# EAGLE design RS232Board (EAGLE 6.4)
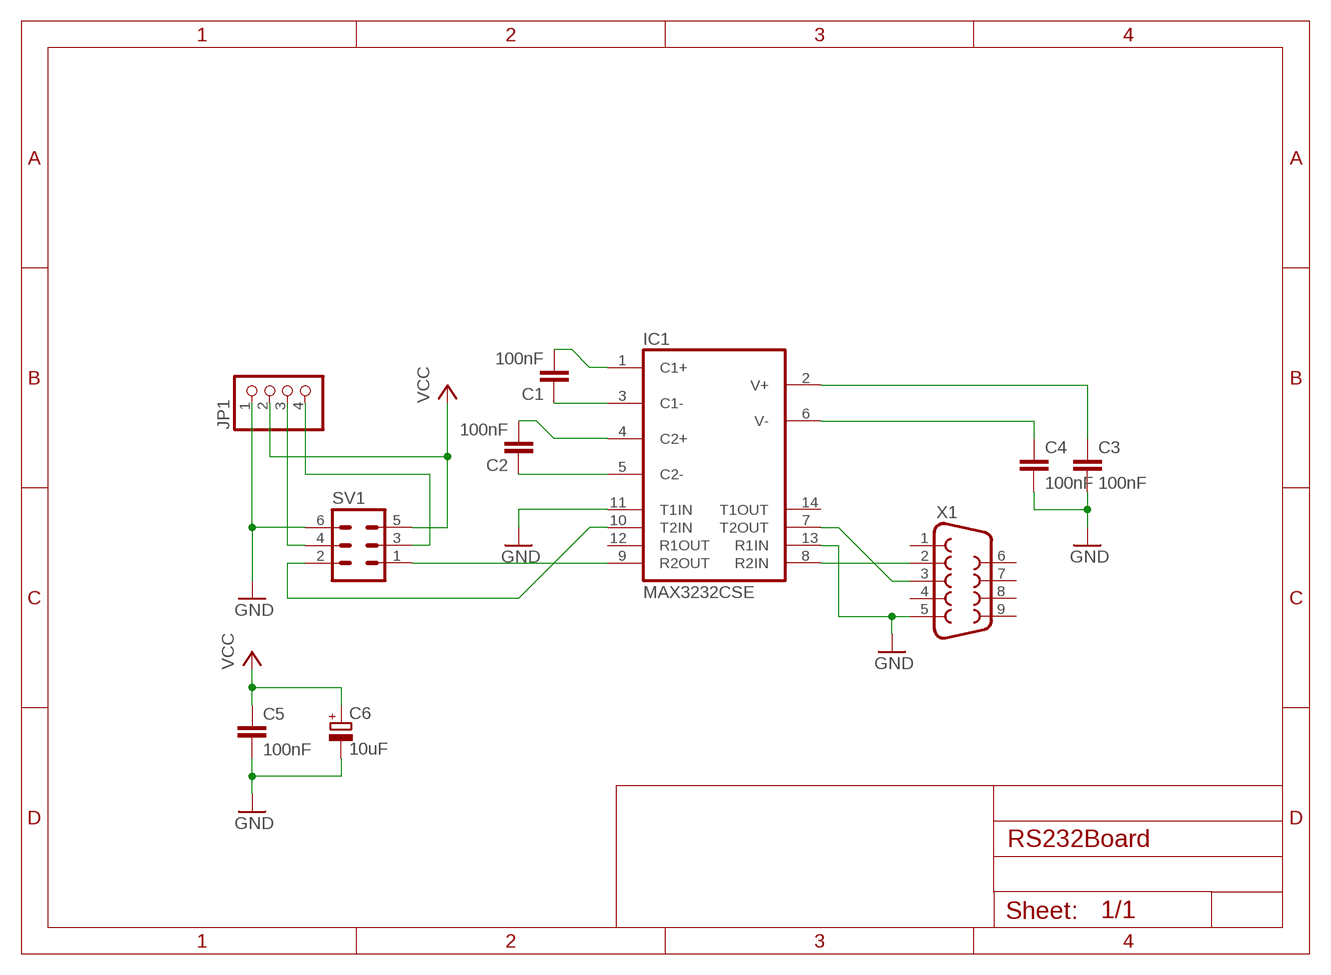
[diagram p0: schematic, sheet 1]

## Parts
C1  100nF  C-EUC1206  [C1206]
C2  100nF  C-EUC1206  [C1206]
C3  100nF  C-EUC1206  [C1206]
C4  100nF  C-EUC1206  [C1206]
C5  100nF  C-EUC1206  [C1206]
C6  10uF  CPOL-EUSMCC  [SMC_C]
IC1  MAX3232CSE  [SO16]
JP1  PINHD-1X4  [1X04]
SV1  ML6  [ML6]
X1  F09HP  [F09HP]

## Nets
GND: C3.2 C4.2 C5.2 C6.- IC1.11(T1IN) IC1.13(R1IN) JP1.1 SV1.6 X1.5
N$1: IC1.8(R2IN) X1.2
N$2: IC1.7(T2OUT) X1.3
N$3: C2.1 IC1.5(C2-)
N$4: C2.2 IC1.4(C2+)
N$5: C1.1 IC1.3(C1-)
N$6: C1.2 IC1.1(C1+)
N$7: C4.1 IC1.6(V-)
N$8: C3.1 IC1.2(V+)
N$9: JP1.3 SV1.4
N$10: IC1.9(R2OUT) SV1.1
N$11: IC1.10(T2IN) SV1.2
N$12: JP1.4 SV1.3
VCC: C5.1 C6.+ JP1.2 SV1.5
Unconnected: IC1.12(R1OUT) IC1.14(T1OUT) X1.1 X1.4 X1.6 X1.7 X1.8 X1.9

## Power pins joined to a net without a drawn wire
GND: IC1.15(GND)
VCC: IC1.16(VCC)

## Library data of the parts
C1-C5 = rcl:C-EU: CAPACITOR, European symbol
C6 = rcl:CPOL-EU: POLARIZED CAPACITOR, European symbol
IC1 = maxim:MAX3232*: True RS-232 Transceivers 3.0V to 5.5V, Low-Power up to 1Mbps, Using Four 0.1µF External Capacitors Source: http://pdfserv.maxim-ic.com/en/ds/MAX3222-MAX3241.pdf; MPN: MAX3232CSE; OC_FARNELL: 9725490; OC_NEWARK: 90C2890
JP1 = pinhead:PINHD-1X4: PIN HEADER
SV1 = con-ml:ML6: HARTING; OC_FARNELL: unknown; OC_NEWARK: unknown
X1 = con-subd:F09: SUB-D; OC_FARNELL: unknown; OC_NEWARK: unknown

## Board
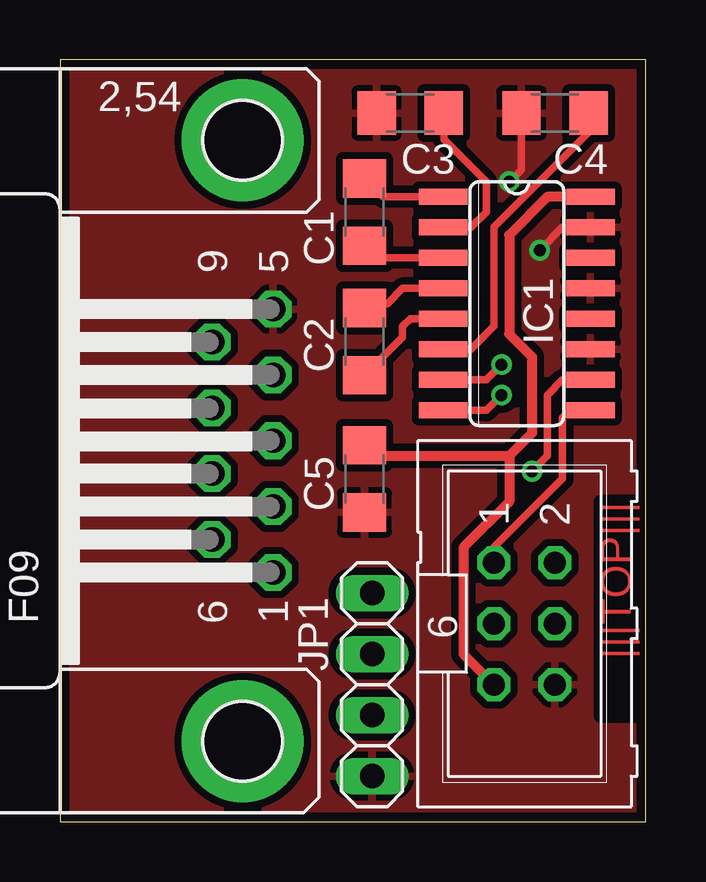
[diagram p1: board, top side]
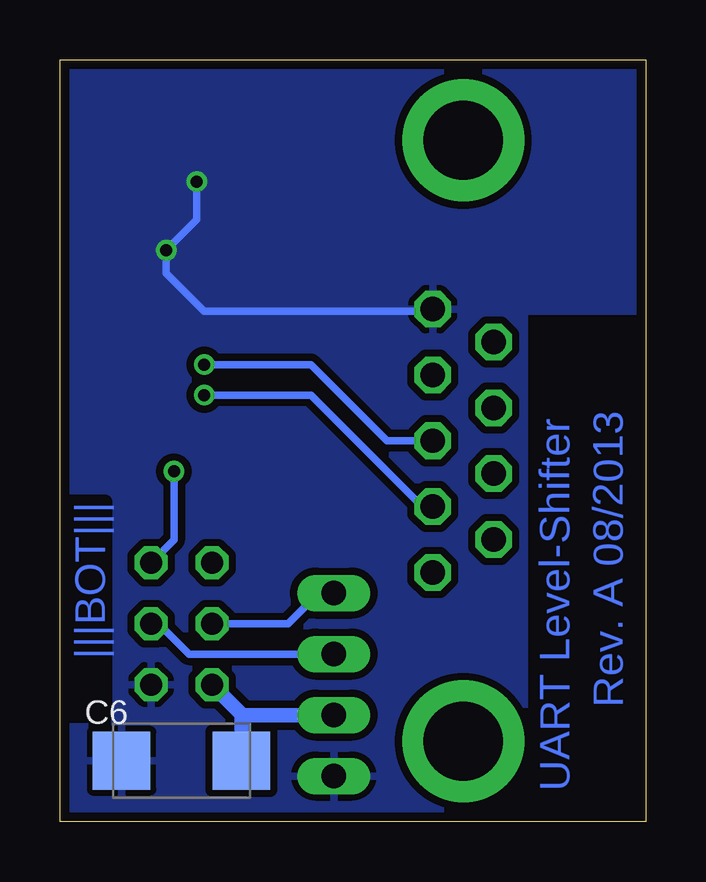
[diagram p2: board, bottom side, seen from below]

Size 24.43 x 31.74 mm. Coordinates in mm from the lower left corner, seen from the top.
Outline: 0,0 24.43,0 24.43,31.74 0,31.74 0,0
Copper layers (1*16): Top 0.0356mm / dielectric 1.5011mm / Bottom 0.0356mm
Design rules "LaenPCBOrder": minimum track width 6mil, minimum drill 13mil, track to track 6mil, track to pad 6mil, pad to pad 6mil, via to via 6mil, smd to smd 6mil, copper to edge 15mil, drill to drill 6mil, minimum pad ring 7mil, minimum via ring 7mil, stop-mask expansion 4mil, vias tented up to drill 0mil, thermal gap 10mil

### Footprints (pad centres in the part's own frame; a part is rotated, then mirrored left to right if it is on the bottom)
C1206 = smd 1.6 x 1.8: 1 -1.4,0; 2 1.4,0
SMC_C = smd 2.4 x 2.4: + -2.5,0; - 2.5,0
SO16 = smd 0.66 x 2.032: 1 -4.445,-3.073; 2 -3.175,-3.073; 3 -1.905,-3.073; 4 -0.635,-3.073; 5 0.635,-3.073; 6 1.905,-3.073; 7 3.175,-3.073; 8 4.445,-3.073; 9 4.445,3.073; 10 3.175,3.073; 11 1.905,3.073; 12 0.635,3.073; 13 -0.635,3.073; 14 -1.905,3.073; 15 -3.175,3.073; 16 -4.445,3.073
1X04 = drill 1.016 long: 1 -3.81,0; 2 -1.27,0; 3 1.27,0; 4 3.81,0
ML6 = drill 0.914 octagon: 1 -2.54,-1.27; 2 -2.54,1.27; 3 0,-1.27; 4 0,1.27; 5 2.54,-1.27; 6 2.54,1.27
F09HP = drill 1.016 octagon: 1 -5.486,-1.27; 2 -2.743,-1.27; 3 0,-1.27; 4 2.743,-1.27; 5 5.486,-1.27; 6 -4.115,1.27; 7 -1.372,1.27; 8 1.372,1.27; 9 4.115,1.27 | drill 3.302 pad 5.08: G1 -12.522,0; G2 12.522,0

### Placement (x,y rotation side)
C1  12.7,25.4 90 top
C2  12.7,20 90 top
C3  14.61,29.53 180 top
C4  20.64,29.53 180 top
C5  12.7,14.29 270 top
C6  19.37,2.54 180 bottom
IC1  19.05,21.59 270 top
JP1  13.02,5.71 90 top
SV1  19.37,8.26 270 top
X1  7.62,15.88 90 top

### Tracks (layer width: path | path; a pad name or v marks a point on that pad's centre or on a via)
GND  (via drill 0.5)
  Top 0.305: IC1.15 20.95,24.77 v20,23.81 | C4.2 19.24,27.18 v18.73,26.67
  Bottom 0.305: X1.5 8.98,21.27 18.41,21.27 20,22.86 v20,23.81 18.73,25.08 v18.73,26.67
  pour Top (isolate 0.305): 24.45,31.75 0.32,31.75 0.32,0 24.45,0
  pour Bottom (isolate 0.305): 5.08,0 24.45,0 24.45,31.75 0.32,31.75 0.32,21.27 5.08,21.27
N$1  (via drill 0.5)
  Top 0.305: v18.41,17.78 17.78,17.14 IC1.8
  Bottom 0.305: X1.2 9.32,13.13 13.97,17.78 v18.41,17.78
N$2  (via drill 0.5)
  Top 0.305: v18.41,19.05 17.78,18.41 IC1.7
  Bottom 0.305: X1.3 10.79,15.88 13.97,19.05 v18.41,19.05
N$3
  Top 0.305: IC1.5 14.61,20.95 14.29,20.64 14.29,20.19 C2.1
N$4
  Top 0.305: IC1.4 14.29,22.23 13.65,21.59 12.89,21.59 C2.2
N$5
  Top 0.305: IC1.3 13.21,23.5 C1.1
N$6
  Top 0.305: IC1.1 13.46,26.04 C1.2
N$7
  Top 0.305: C4.1 22.04,28.7 18.1,24.77 18.1,20.64 17.14,19.68 IC1.6
N$8
  Top 0.305: C3.1 16,28.45 17.78,26.67 17.78,25.4 17.14,24.77 IC1.2
N$9
  Bottom 0.305: SV1.4 20.32,8.26 19.05,6.99 JP1.3
N$10
  Top 0.305: IC1.9 21.27,17.14 20.95,16.83 20.95,14.29 18.1,11.43 SV1.1
N$11  (via drill 0.5)
  Top 0.305: v19.68,14.61 20.32,15.24 20.32,17.78 20.95,18.41 IC1.10
  Bottom 0.305: v19.68,14.61 19.68,11.75 SV1.2
N$12
  Bottom 0.305: SV1.3 14.92,8.26 13.65,9.53 JP1.4
VCC
  Top 0.406: IC1.16 20.32,26.04 18.73,24.45 18.73,20.32 19.68,19.37 19.68,16.19 18.73,15.24 | C5.1 13.15,15.24 18.73,15.24 | 18.73,15.24 18.73,13.34 16.83,11.43 16.83,6.99 SV1.5
  Bottom 0.61: C6.+ 16.87,4.45 | 16.87,4.45 16.87,4.49 SV1.5 | JP1.2 16.87,4.45

### Text on the board
Top: |||TOP|||
Bottom: Rev. A 08/2013 | |||BOT||| | UART Level-Shifter